# EasyEDA schematic EsayEDA_schematic_for_PrismFX.json
TITLE: Sheet_1; REV: 1.0; Date: 2024-12-17; Sheet: 1/1; Drawn By: bobnorby; Company: Your Company
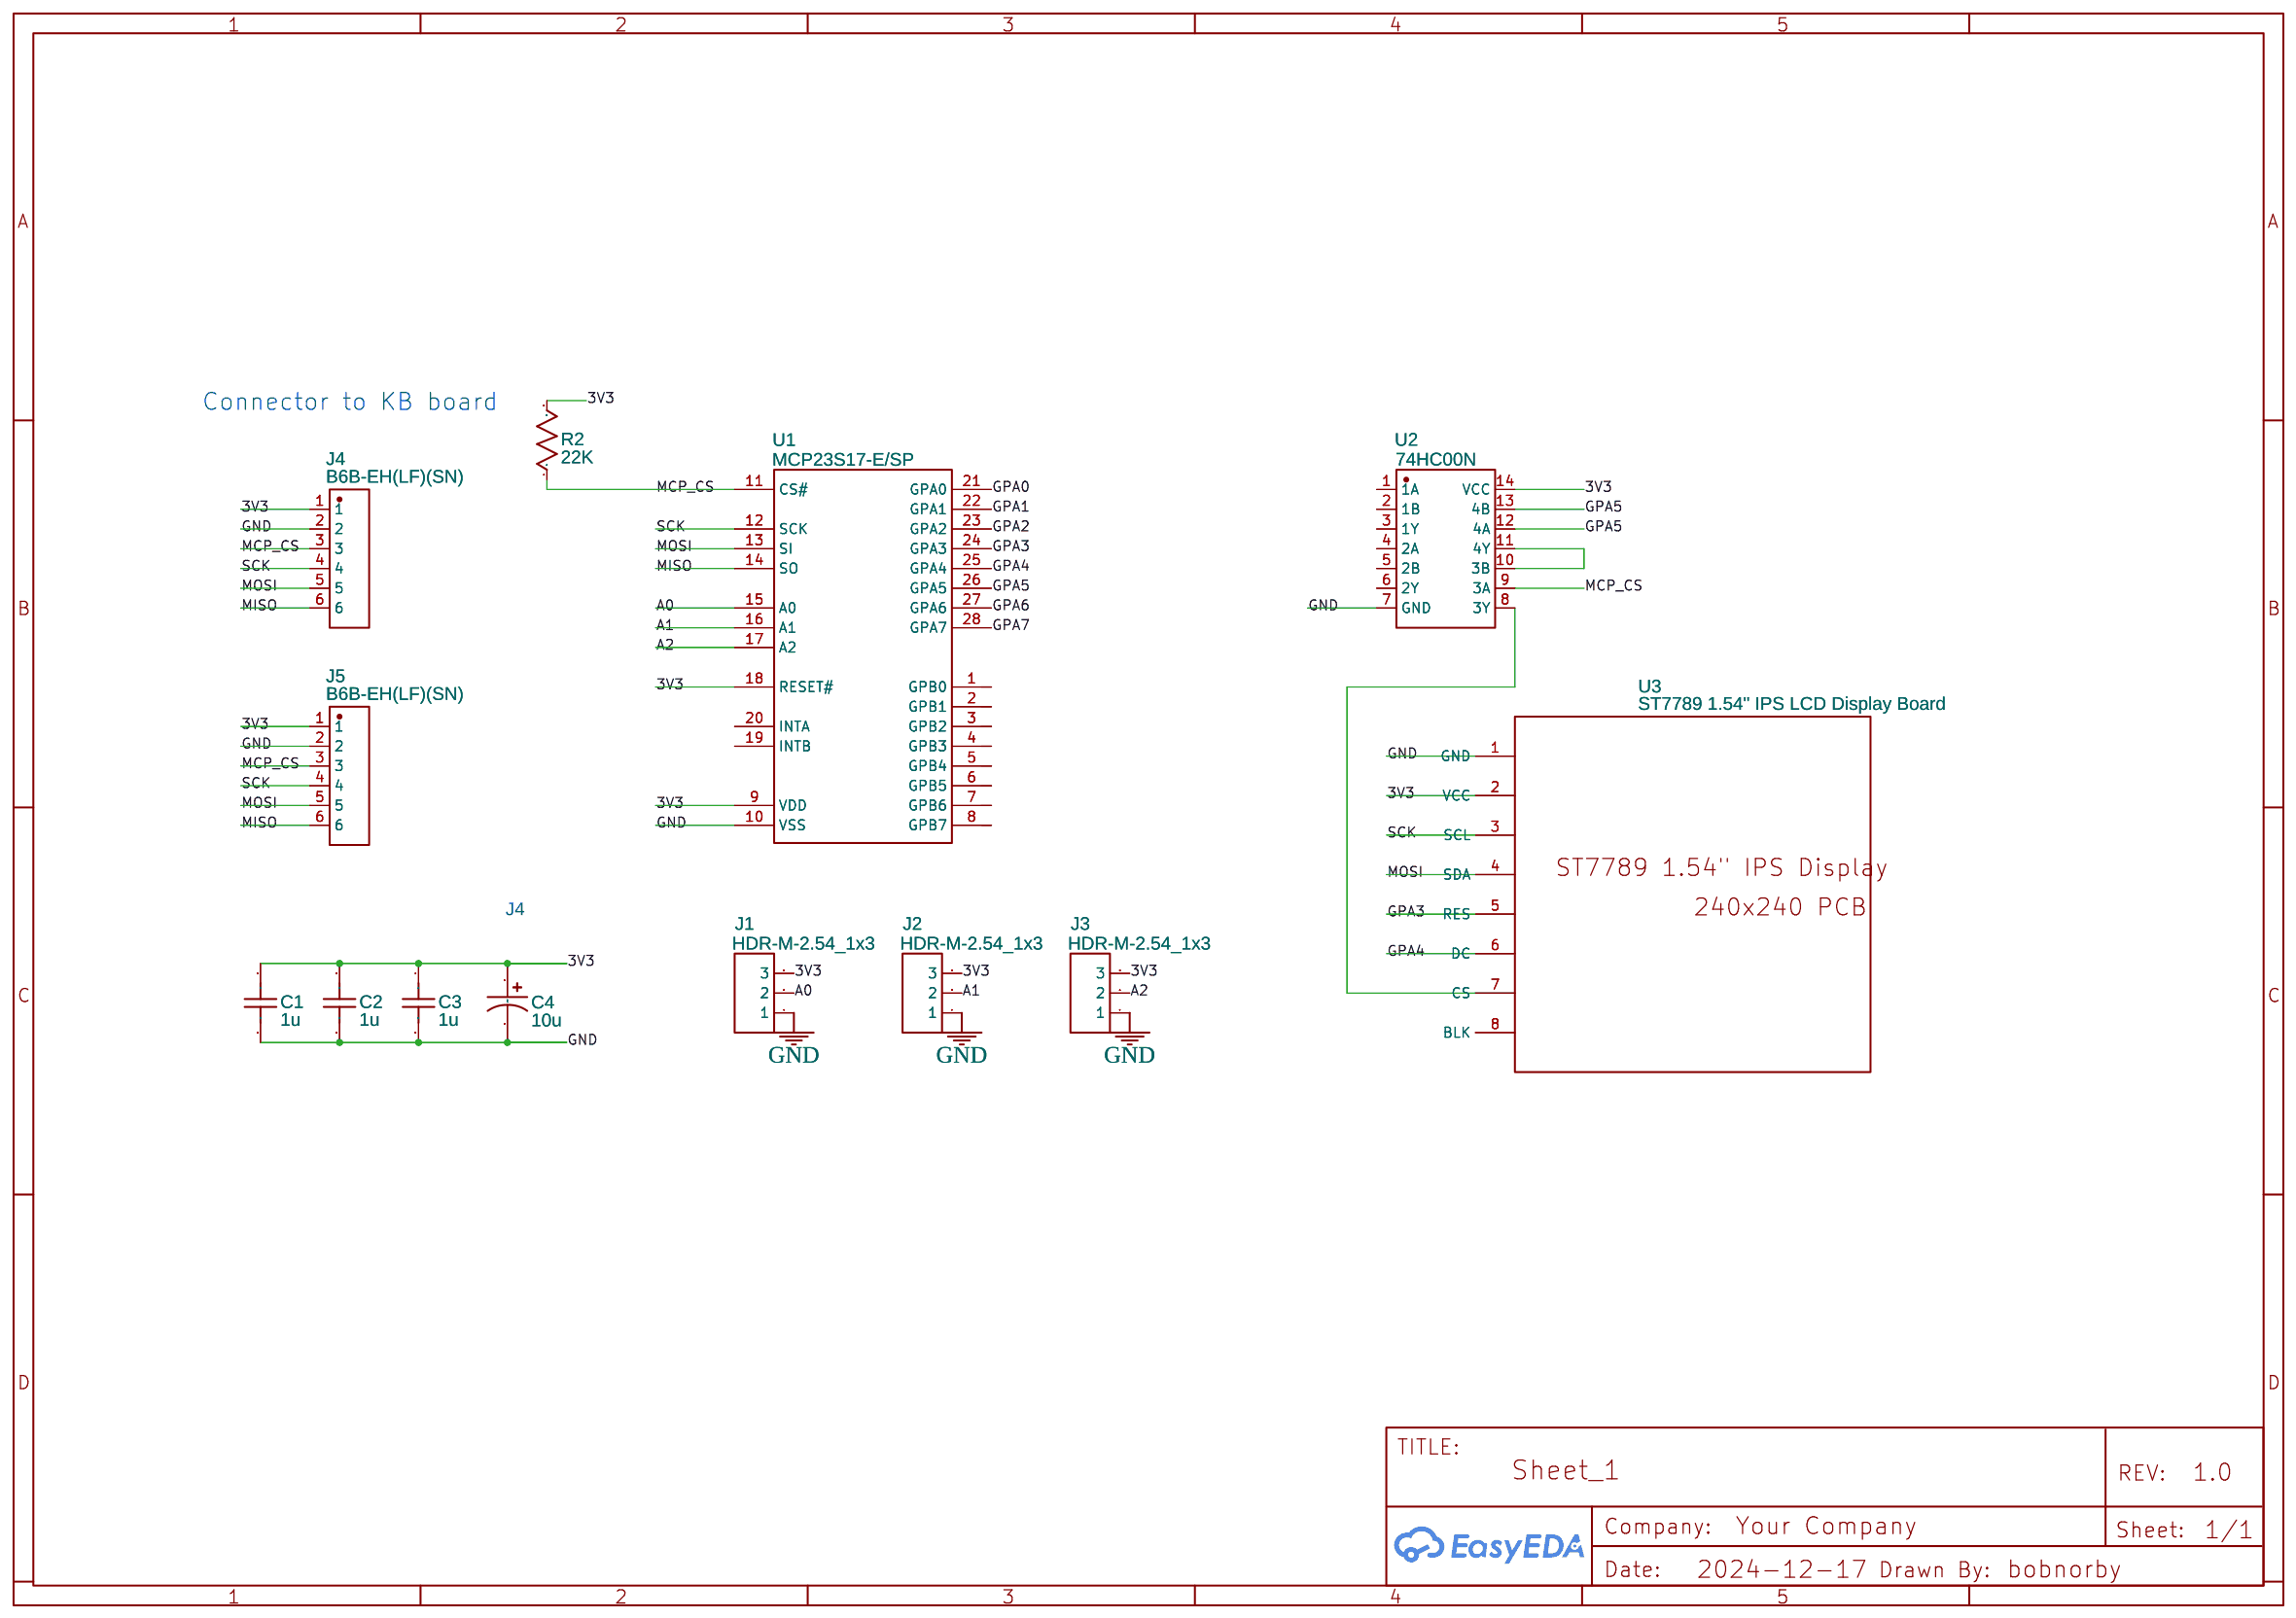
[diagram p0: schematic sheet]

## Parts
C1  1u  [RAD-0.1]
C2  1u  [RAD-0.1]
C3  1u  [RAD-0.1]
C4  10u  [CAP-D5.0×F2.0]
J1  HDR-M-2.54_1x3  [HDR-M-2.54_1X3]
J2  HDR-M-2.54_1x3  [HDR-M-2.54_1X3]
J3  HDR-M-2.54_1x3  [HDR-M-2.54_1X3]
J4  B6B-EH(LF)(SN)  [CONN-TH_6P-P2.50_JST_B6B-EH-LF-SN]
J5  B6B-EH(LF)(SN)  [CONN-TH_6P-P2.50_JST_B6B-EH-LF-SN]
R2  22K  [R_AXIAL-0.3]
U1  MCP23S17-E/SP  [DIP-28_L34.6-W7.3-P2.54-LS10.2-BL]
U2  74HC00N  [DIP-14_L19.4-W6.4-P2.54-LS7.6-BL]
U3  ST7789 1.54" IPS LCD Display Board  [ST7789154IPS]

## Library data of the parts
C1-C3 = C_RAD-0.1_US: Contributor: LCEDA_Lib
C4 = CE_TH_D5.0×F2.0_US: Contributor: LCEDA_Lib
J1-J3 = HDR-M-2.54_1x3: Supplier Part: C180248; Supplier: LCSC; Contributor: LCEDA_Lib
J4 J5 = B6B-EH(LF)(SN): Contributor: LCSC; Supplier: LCSC; Supplier Part: C493147; Manufacturer: JST; JLCPCB Part Class: Extended Part
R2 = R_AXIAL-0.3_US: Contributor: LCEDA_Lib
U1 = MCP23S17-E/SP: Contributor: LCSC; Supplier: LCSC; Manufacturer: MICROCHIP(美国微芯); Supplier Part: C148096; JLCPCB Part Class: Extended Part
U2 = 74HC00N: Contributor: LCSC; Supplier: LCSC; Supplier Part: C507194; Manufacturer: HGSEMI(华冠); JLCPCB Part Class: Extended Part
U3 = ST7789 1.54" IPS LCD Display Board: Contributor: pietro.grosso9

## Nets
3V3: C1.1 C2.1 C3.1 C4.1 J1.3 J2.3 J3.3 J4.1 J5.1 R2.2 U1.9(VDD) U1.18(RESET#) U2.14(VCC) U3.2(VCC)
GND: C1.2 C2.2 C3.2 C4.2 J1.1 J2.1 J3.1 J4.2 J5.2 U1.10(VSS) U2.7(GND) U3.1(GND)
A0: J1.2 U1.15(A0)
A1: J2.2 U1.16(A1)
A2: J3.2 U1.17(A2)
GPA0: U1.21(GPA0)
GPA1: U1.22(GPA1)
GPA2: U1.23(GPA2)
GPA3: U1.24(GPA3) U3.5(RES)
GPA4: U1.25(GPA4) U3.6(DC)
GPA5: U1.26(GPA5) U2.12(4A) U2.13(4B)
GPA6: U1.27(GPA6)
GPA7: U1.28(GPA7)
MCP_CS: J4.3 J5.3 R2.1 U1.11(CS#) U2.9(3A)
MISO: J4.6 J5.6 U1.14(SO)
MOSI: J4.5 J5.5 U1.13(SI) U3.4(SDA)
SCK: J4.4 J5.4 U1.12(SCK) U3.3(SCL)
Net-(U2-8): U2.8(3Y) U3.7(CS)
Net-(U2-10): U2.10(3B) U2.11(4Y)

Not connected (* = marked no-connect by the designer): U1 1(GPB0) 2(GPB1) 3(GPB2) 4(GPB3) 5(GPB4) 6(GPB5) 7(GPB6) 8(GPB7) 19(INTB) 20(INTA); U2 1(1A) 2(1B) 3(1Y) 4(2A) 5(2B) 6(2Y); U3 8(BLK)

## Notes on the sheet
- Connector to KB board
- J4
